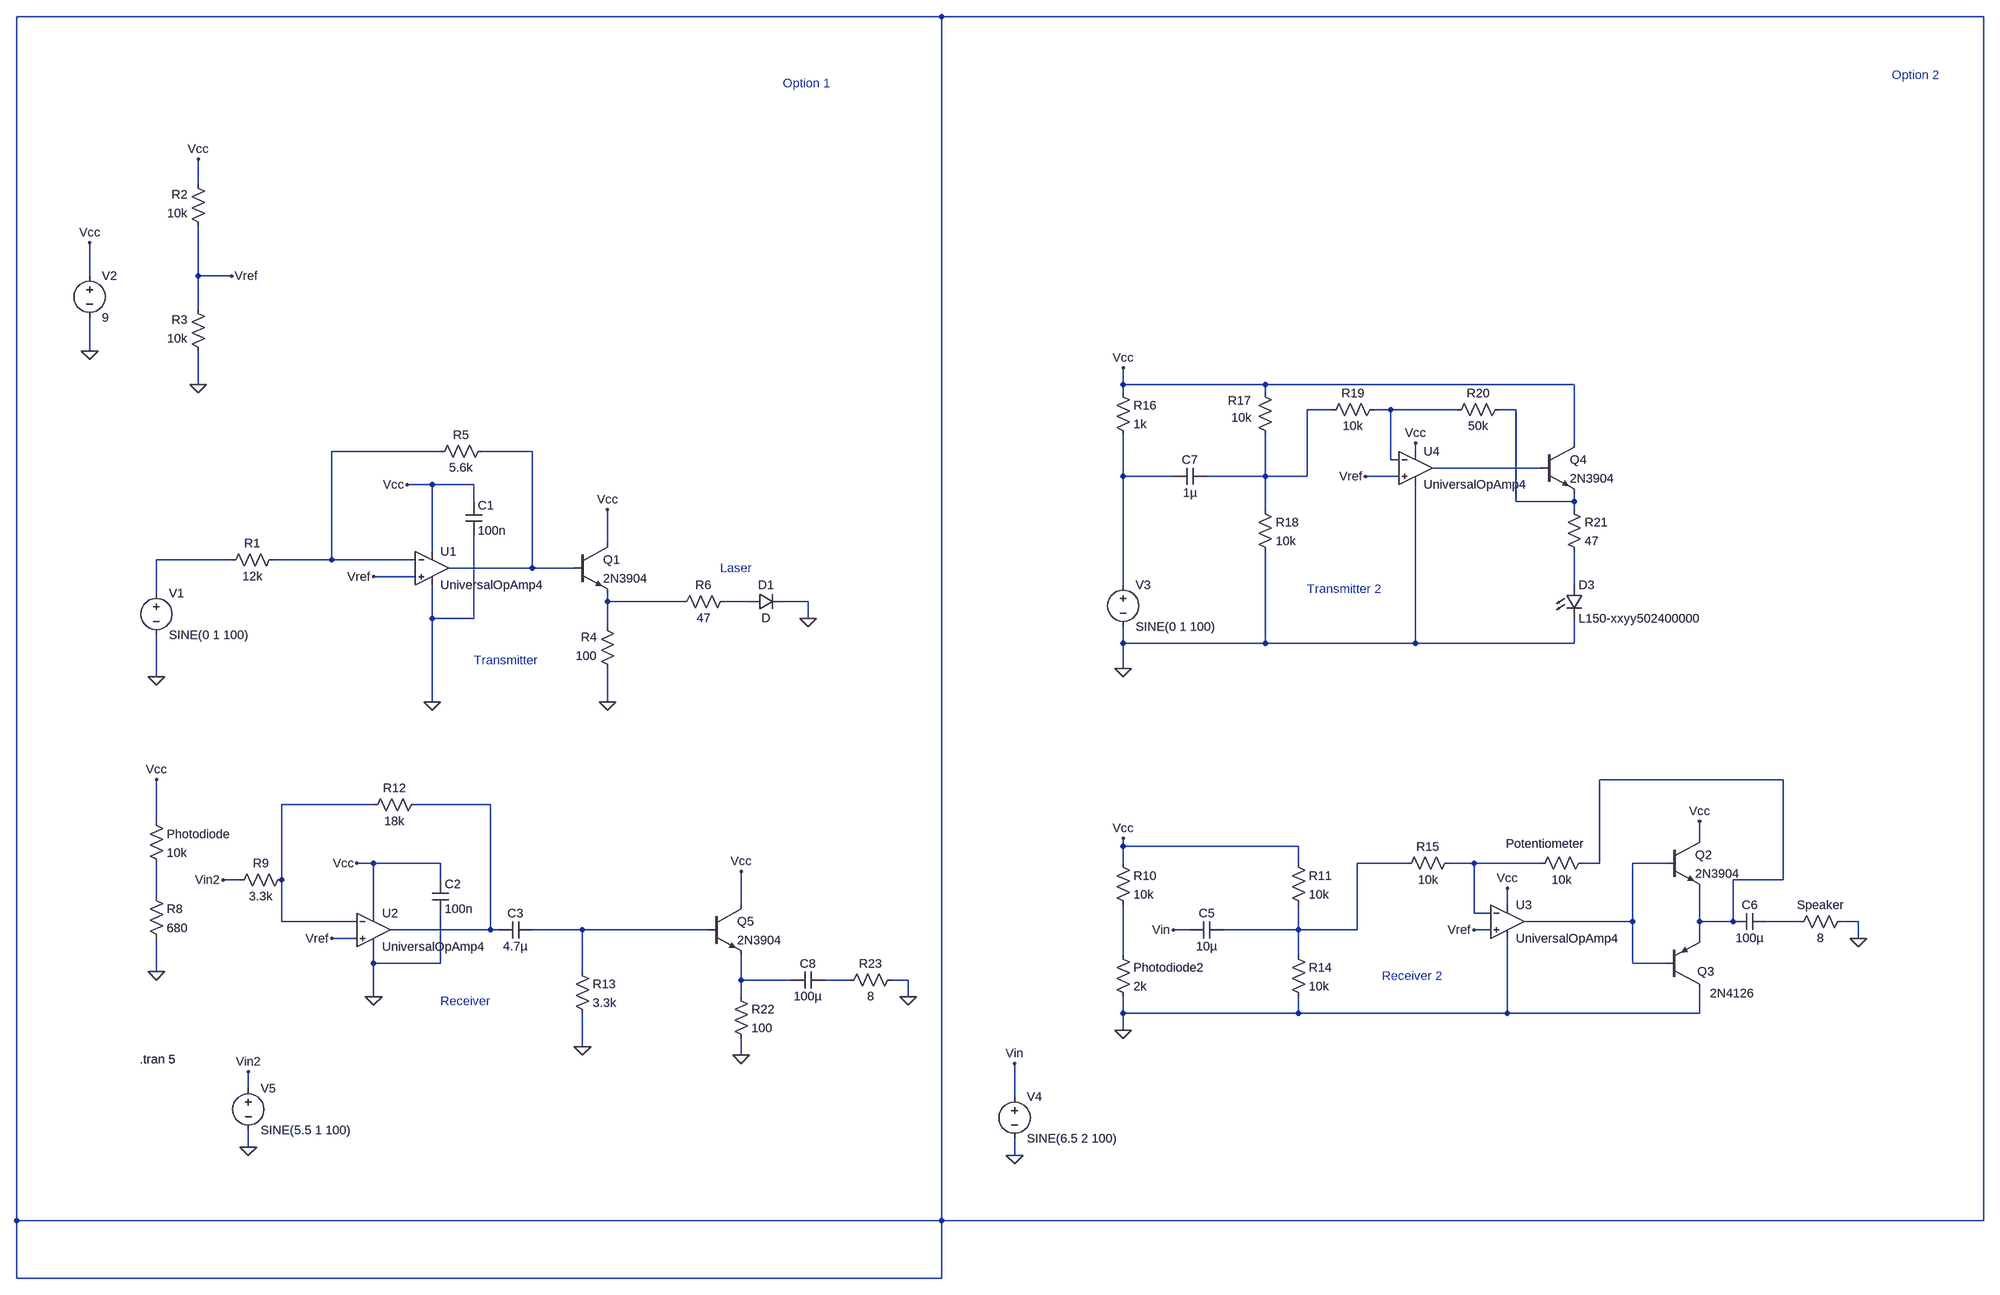
[diagram p0: schematic Draft1.asc]
Draft1.asc, the LTspice schematic file:
Version 4
SHEET 1 3524 4292
WIRE 1456 -944 -624 -944
WIRE 3520 -944 1456 -944
WIRE 32 -608 32 -656
WIRE -176 -432 -176 -496
WIRE 32 -432 32 -528
WIRE 96 -432 32 -432
WIRE 32 -368 32 -432
WIRE -176 -288 -176 -352
WIRE 32 -224 32 -288
WIRE 1872 -224 1872 -256
WIRE 2144 -224 1872 -224
WIRE 2736 -224 2144 -224
WIRE 1872 -208 1872 -224
WIRE 2144 -208 2144 -224
WIRE 2272 -176 2224 -176
WIRE 2384 -176 2352 -176
WIRE 2512 -176 2384 -176
WIRE 2624 -176 2592 -176
WIRE 2736 -112 2736 -224
WIRE 496 -96 288 -96
WIRE 672 -96 576 -96
WIRE 2432 -96 2432 -112
WIRE 2384 -80 2384 -176
WIRE 2400 -80 2384 -80
WIRE 2672 -64 2464 -64
WIRE 1872 -48 1872 -128
WIRE 1968 -48 1872 -48
WIRE 2144 -48 2144 -128
WIRE 2144 -48 2032 -48
WIRE 2224 -48 2224 -176
WIRE 2224 -48 2144 -48
WIRE 2400 -48 2336 -48
WIRE 480 -32 432 -32
WIRE 560 -32 480 -32
WIRE 560 0 560 -32
WIRE 2624 0 2624 -176
WIRE 2736 0 2736 -16
WIRE 2736 0 2624 0
WIRE 2144 16 2144 -48
WIRE 2736 16 2736 0
WIRE 816 80 816 16
WIRE 480 96 480 -32
WIRE 96 112 -48 112
WIRE 288 112 288 -96
WIRE 288 112 176 112
WIRE 448 112 288 112
WIRE 672 128 672 -96
WIRE 672 128 512 128
WIRE 752 128 672 128
WIRE 448 144 368 144
WIRE 1872 160 1872 -48
WIRE 2736 160 2736 96
WIRE -48 176 -48 112
WIRE 816 192 816 176
WIRE 960 192 816 192
WIRE 1088 192 1040 192
WIRE 1200 192 1152 192
WIRE 480 224 480 160
WIRE 560 224 560 64
WIRE 560 224 480 224
WIRE 1200 224 1200 192
WIRE 816 240 816 192
WIRE 1872 272 1872 240
WIRE 2144 272 2144 96
WIRE 2144 272 1872 272
WIRE 2432 272 2432 -32
WIRE 2432 272 2144 272
WIRE 2736 272 2736 224
WIRE 2736 272 2432 272
WIRE 1872 320 1872 272
WIRE -48 336 -48 256
WIRE 480 384 480 224
WIRE 816 384 816 320
WIRE 3136 560 2784 560
WIRE 368 608 192 608
WIRE 592 608 448 608
WIRE -48 640 -48 560
WIRE 2976 672 2976 640
WIRE 1872 688 1872 672
WIRE 2208 688 1872 688
WIRE 368 720 336 720
WIRE 496 720 368 720
WIRE 1872 720 1872 688
WIRE 2208 720 2208 688
WIRE 2416 720 2320 720
WIRE 2544 720 2496 720
WIRE 2672 720 2544 720
WIRE 2784 720 2784 560
WIRE 2784 720 2752 720
WIRE 2912 720 2848 720
WIRE 112 752 80 752
WIRE 192 752 192 608
WIRE 496 752 496 720
WIRE 3136 752 3136 560
WIRE 3136 752 3040 752
WIRE -48 784 -48 720
WIRE 1072 800 1072 736
WIRE 2608 800 2608 768
WIRE 368 816 368 720
WIRE 2544 816 2544 720
WIRE 2576 816 2544 816
WIRE 192 832 192 752
WIRE 336 832 192 832
WIRE 2848 832 2848 720
WIRE 2848 832 2640 832
WIRE 2976 832 2976 768
WIRE 3040 832 3040 752
WIRE 3040 832 2976 832
WIRE 3168 832 3104 832
WIRE 3280 832 3248 832
WIRE 592 848 592 608
WIRE 592 848 400 848
WIRE 608 848 592 848
WIRE 768 848 672 848
WIRE 1008 848 768 848
WIRE 2000 848 1968 848
WIRE 2208 848 2208 800
WIRE 2208 848 2064 848
WIRE 2320 848 2320 720
WIRE 2320 848 2208 848
WIRE 2576 848 2544 848
WIRE 336 864 288 864
WIRE 2976 864 2976 832
WIRE 3280 864 3280 832
WIRE 1872 896 1872 800
WIRE 2208 896 2208 848
WIRE 368 912 368 880
WIRE 496 912 496 816
WIRE 496 912 368 912
WIRE 2848 912 2848 832
WIRE 2912 912 2848 912
WIRE -48 928 -48 864
WIRE 768 928 768 848
WIRE 1072 944 1072 896
WIRE 1168 944 1072 944
WIRE 1280 944 1232 944
WIRE 1392 944 1360 944
WIRE 368 976 368 912
WIRE 1072 976 1072 944
WIRE 1392 976 1392 944
WIRE 1872 1008 1872 976
WIRE 2208 1008 2208 976
WIRE 2208 1008 1872 1008
WIRE 2608 1008 2608 864
WIRE 2608 1008 2208 1008
WIRE 2976 1008 2976 960
WIRE 2976 1008 2608 1008
WIRE 1872 1040 1872 1008
WIRE 768 1072 768 1008
WIRE 1072 1088 1072 1056
WIRE 128 1152 128 1120
WIRE 1664 1168 1664 1104
WIRE 128 1264 128 1232
WIRE 1664 1280 1664 1248
WIRE -624 1472 -624 -944
WIRE 1456 1472 1456 -944
WIRE 1456 1472 -624 1472
WIRE 3520 1472 3520 -944
WIRE 3520 1472 1456 1472
WIRE -624 4288 -624 1472
WIRE 1456 4288 1456 1472
WIRE 1456 4288 -624 4288
FLAG -48 336 0
FLAG 480 384 0
FLAG 816 384 0
FLAG 1200 224 0
FLAG 816 16 Vcc
FLAG 32 -656 Vcc
FLAG 432 -32 Vcc
FLAG -176 -288 0
FLAG -176 -496 Vcc
FLAG -48 928 0
FLAG 368 976 0
FLAG 768 1072 0
FLAG -48 560 Vcc
FLAG 336 720 Vcc
FLAG 96 -432 Vref
FLAG 368 144 Vref
FLAG 288 864 Vref
FLAG 32 -224 0
FLAG 1872 1040 0
FLAG 1872 672 Vcc
FLAG 2608 768 Vcc
FLAG 2976 640 Vcc
FLAG 3280 864 0
FLAG 1872 320 0
FLAG 1872 -256 Vcc
FLAG 2432 -112 Vcc
FLAG 2336 -48 Vref
FLAG 2544 848 Vref
FLAG 1072 736 Vcc
FLAG 1072 1088 0
FLAG 1392 976 0
FLAG 1664 1280 0
FLAG 1664 1104 Vin
FLAG 1968 848 Vin
FLAG 128 1120 Vin2
FLAG 128 1264 0
FLAG 80 752 Vin2
SYMBOL voltage -48 160 R0
WINDOW 123 0 0 Left 0
WINDOW 39 0 0 Left 0
SYMATTR InstName V1
SYMATTR Value SINE(0 1 100)
SYMBOL res 192 96 R90
WINDOW 0 0 56 VBottom 2
WINDOW 3 32 56 VTop 2
SYMATTR InstName R1
SYMATTR Value 12k
SYMBOL res 48 -512 R180
WINDOW 0 36 76 Left 2
WINDOW 3 36 40 Left 2
SYMATTR InstName R2
SYMATTR Value 10k
SYMBOL res 48 -272 R180
WINDOW 0 36 76 Left 2
WINDOW 3 36 40 Left 2
SYMATTR InstName R3
SYMATTR Value 10k
SYMBOL res 832 336 R180
WINDOW 0 36 76 Left 2
WINDOW 3 36 40 Left 2
SYMATTR InstName R4
SYMATTR Value 100
SYMBOL OpAmps\\UniversalOpAmp4 480 128 R0
SYMATTR InstName U1
SYMBOL res 592 -112 R90
WINDOW 0 0 56 VBottom 2
WINDOW 3 32 56 VTop 2
SYMATTR InstName R5
SYMATTR Value 5.6k
SYMBOL res 1056 176 R90
WINDOW 0 0 56 VBottom 2
WINDOW 3 32 56 VTop 2
SYMATTR InstName R6
SYMATTR Value 47
SYMBOL cap 544 0 R0
SYMATTR InstName C1
SYMATTR Value 100n
SYMBOL diode 1088 208 R270
WINDOW 0 32 32 VTop 2
WINDOW 3 0 32 VBottom 2
SYMATTR InstName D1
SYMBOL npn 752 80 R0
SYMATTR InstName Q1
SYMATTR Value 2N3904
SYMBOL voltage -176 -448 R0
WINDOW 123 0 0 Left 0
WINDOW 39 0 0 Left 0
SYMATTR InstName V2
SYMATTR Value 9
SYMBOL res -64 624 R0
SYMATTR InstName Photodiode
SYMATTR Value 10k
SYMBOL res -64 768 R0
SYMATTR InstName R8
SYMATTR Value 680
SYMBOL res 208 736 R90
WINDOW 0 0 56 VBottom 2
WINDOW 3 32 56 VTop 2
SYMATTR InstName R9
SYMATTR Value 3.3k
SYMBOL res 352 624 R270
WINDOW 0 32 56 VTop 2
WINDOW 3 0 56 VBottom 2
SYMATTR InstName R12
SYMATTR Value 18k
SYMBOL res 752 912 R0
SYMATTR InstName R13
SYMATTR Value 3.3k
SYMBOL OpAmps\\UniversalOpAmp4 368 848 R0
SYMATTR InstName U2
SYMBOL cap 480 752 R0
SYMATTR InstName C2
SYMATTR Value 100n
SYMBOL cap 672 832 R90
WINDOW 0 0 32 VBottom 2
WINDOW 3 32 32 VTop 2
SYMATTR InstName C3
SYMATTR Value 4.7µ
SYMBOL res 1856 880 R0
SYMATTR InstName Photodiode2
SYMATTR Value 2k
SYMBOL res 1856 704 R0
SYMATTR InstName R10
SYMATTR Value 10k
SYMBOL cap 2064 832 R90
WINDOW 0 0 32 VBottom 2
WINDOW 3 32 32 VTop 2
SYMATTR InstName C5
SYMATTR Value 10µ
SYMBOL res 2192 704 R0
SYMATTR InstName R11
SYMATTR Value 10k
SYMBOL res 2192 880 R0
SYMATTR InstName R14
SYMATTR Value 10k
SYMBOL OpAmps\\UniversalOpAmp4 2608 832 R0
SYMATTR InstName U3
SYMBOL res 2512 704 R90
WINDOW 0 0 56 VBottom 2
WINDOW 3 32 56 VTop 2
SYMATTR InstName R15
SYMATTR Value 10k
SYMBOL res 2768 704 R90
WINDOW 0 -6 87 VBottom 2
WINDOW 3 32 56 VTop 2
SYMATTR InstName Potentiometer
SYMATTR Value 10k
SYMBOL npn 2912 672 R0
SYMATTR InstName Q2
SYMATTR Value 2N3904
SYMBOL cap 3104 816 R90
WINDOW 0 0 32 VBottom 2
WINDOW 3 32 32 VTop 2
SYMATTR InstName C6
SYMATTR Value 100µ
SYMBOL res 3264 816 R90
WINDOW 0 0 56 VBottom 2
WINDOW 3 32 56 VTop 2
SYMATTR InstName Speaker
SYMATTR Value 8
SYMBOL voltage 1872 144 R0
WINDOW 123 0 0 Left 0
WINDOW 39 0 0 Left 0
SYMATTR InstName V3
SYMATTR Value SINE(0 1 100)
SYMBOL res 1856 -224 R0
SYMATTR InstName R16
SYMATTR Value 1k
SYMBOL cap 2032 -64 R90
WINDOW 0 0 32 VBottom 2
WINDOW 3 32 32 VTop 2
SYMATTR InstName C7
SYMATTR Value 1µ
SYMBOL res 2128 -224 R0
WINDOW 0 -55 31 Left 2
WINDOW 3 -49 63 Left 2
SYMATTR InstName R17
SYMATTR Value 10k
SYMBOL res 2128 0 R0
SYMATTR InstName R18
SYMATTR Value 10k
SYMBOL OpAmps\\UniversalOpAmp4 2432 -64 R0
SYMATTR InstName U4
SYMBOL res 2368 -192 R90
WINDOW 0 0 56 VBottom 2
WINDOW 3 32 56 VTop 2
SYMATTR InstName R19
SYMATTR Value 10k
SYMBOL res 2608 -192 R90
WINDOW 0 0 56 VBottom 2
WINDOW 3 32 56 VTop 2
SYMATTR InstName R20
SYMATTR Value 50k
SYMBOL npn 2672 -112 R0
SYMATTR InstName Q4
SYMATTR Value 2N3904
SYMBOL LED 2720 160 R0
SYMATTR InstName D3
SYMATTR Value L150-xxyy502400000
SYMATTR Description Diode
SYMATTR Type diode
SYMBOL res 2720 0 R0
SYMATTR InstName R21
SYMATTR Value 47
SYMBOL npn 1008 800 R0
SYMATTR InstName Q5
SYMATTR Value 2N3904
SYMBOL res 1056 960 R0
SYMATTR InstName R22
SYMATTR Value 100
SYMBOL res 1376 928 R90
WINDOW 0 0 56 VBottom 2
WINDOW 3 32 56 VTop 2
SYMATTR InstName R23
SYMATTR Value 8
SYMBOL cap 1232 928 R90
WINDOW 0 0 32 VBottom 2
WINDOW 3 32 32 VTop 2
SYMATTR InstName C8
SYMATTR Value 100µ
SYMBOL voltage 1664 1152 R0
WINDOW 123 0 0 Left 0
WINDOW 39 0 0 Left 0
SYMATTR InstName V4
SYMATTR Value SINE(6.5 2 100)
SYMBOL pnp 2912 960 M180
WINDOW 0 60 32 Left 2
WINDOW 3 84 -9 Left 2
SYMATTR InstName Q3
SYMATTR Value 2N4126
SYMBOL voltage 128 1136 R0
WINDOW 123 0 0 Left 0
WINDOW 39 0 0 Left 0
SYMATTR InstName V5
SYMATTR Value SINE(5.5 1 100)
TEXT 560 304 Left 2 ;Transmitter
TEXT 496 984 Left 2 ;Receiver
TEXT -80 1096 Left 2 !.tran 5
TEXT 1032 128 Left 2 ;Laser
TEXT 2368 936 Left 2 ;Receiver 2
TEXT 1152 -816 Left 2 ;Option 1
TEXT 3344 -832 Left 2 ;Option 2
TEXT 2224 168 Left 2 ;Transmitter 2

The netlist it stands for:
* Draft1.asc
V1 N009 0 SINE(0 1 100)
R1 N005 N009 12k
R2 Vref Vcc 10k
R3 0 Vref 10k
R4 0 N011 100
* U1: UniversalOpAmp4 (symbol OpAmps\UniversalOpAmp4 not available, pins judged from their places): In+=Vref In-=N005 V+=Vcc V-=0 OUT=N006
R5 N006 N005 5.6k
R6 N012 N011 47
C1 Vcc 0 100n
D1 N012 0 D
Q1 Vcc N006 N011 0 2N3904
V2 Vcc 0 9
R§Photodiode Vcc N019 10k
R8 N019 0 680
R9 N014 Vin2 3.3k
R12 N014 N015 18k
R13 N021 0 3.3k
* U2: UniversalOpAmp4 (symbol OpAmps\UniversalOpAmp4 not available, pins judged from their places): In+=Vref In-=N014 V+=Vcc V-=0 OUT=N015
C2 Vcc 0 100n
C3 N021 N015 4.7µ
R§Photodiode2 N022 0 2k
R10 Vcc N022 10k
C5 N016 Vin 10µ
R11 Vcc N016 10k
R14 N016 0 10k
* U3: UniversalOpAmp4 (symbol OpAmps\UniversalOpAmp4 not available, pins judged from their places): In+=Vref In-=N017 V+=Vcc V-=0 OUT=N018
R15 N017 N016 10k
R§Potentiometer N013 N017 10k
Q2 Vcc N018 N013 0 2N3904
C6 N020 N013 100µ
R§Speaker 0 N020 8
V3 N008 0 SINE(0 1 100)
R16 Vcc N008 1k
C7 N002 N008 1µ
R17 Vcc N002 10k
R18 N002 0 10k
* U4: UniversalOpAmp4 (symbol OpAmps\UniversalOpAmp4 not available, pins judged from their places): In+=Vref In-=N003 V+=Vcc V-=0 OUT=N007
R19 N003 N002 10k
R20 N004 N003 50k
Q4 Vcc N007 N004 0 2N3904
D3 N010 0 L150-xxyy502400000
R21 N004 N010 47
Q5 Vcc N021 N023 0 2N3904
R22 N023 0 100
R23 0 N024 8
C8 N024 N023 100µ
V4 Vin 0 SINE(6.5 2 100)
Q3 0 N018 N013 0 2N4126
V5 Vin2 0 SINE(5.5 1 100)
.model D D
.lib standard.dio
.model NPN NPN
.model PNP PNP
.lib standard.bjt
* Transmitter
* Receiver
.tran 5
* Laser
* Receiver 2
* Option 1
* Option 2
* Transmitter 2
.backanno
.end